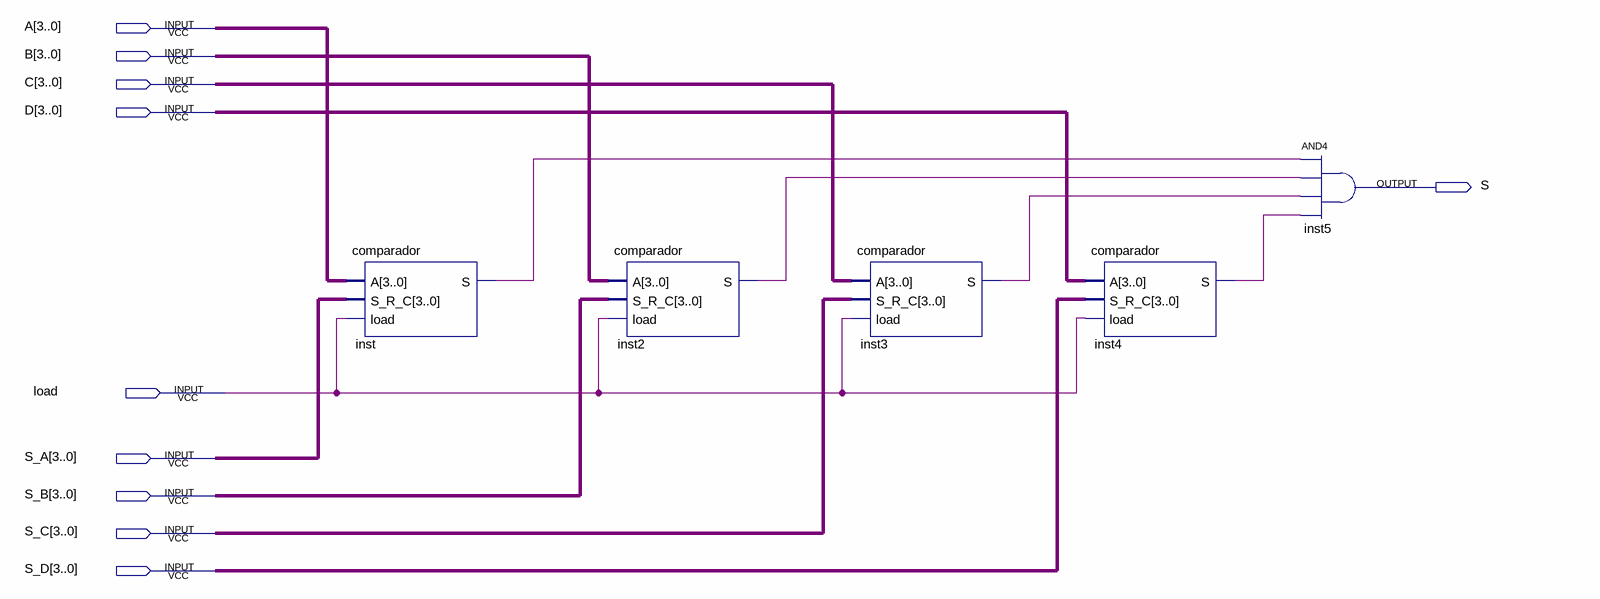
[diagram p0: schematic sheet]
// Quartus schematic comp_todos.bdf as structural Verilog: 5 symbols, 10 pins
module comp_todos (
  input  [3:0] A,
  input  [3:0] B,
  input  [3:0] C,
  input  [3:0] D,
  input  load,
  input  [3:0] S_A,
  input  [3:0] S_B,
  input  [3:0] S_C,
  input  [3:0] S_D,
  output S
);

  wire inst2_s, inst3_s, inst4_s, inst_s;

  comparador inst (.A(A), .S_R_C(S_A), .load(load), .S(inst_s));
  comparador inst2 (.A(B), .S_R_C(S_B), .load(load), .S(inst2_s));
  comparador inst3 (.A(C), .S_R_C(S_C), .load(load), .S(inst3_s));
  comparador inst4 (.A(D), .S_R_C(S_D), .load(load), .S(inst4_s));
  and inst5 (S, inst_s, inst2_s, inst3_s, inst4_s);
endmodule
